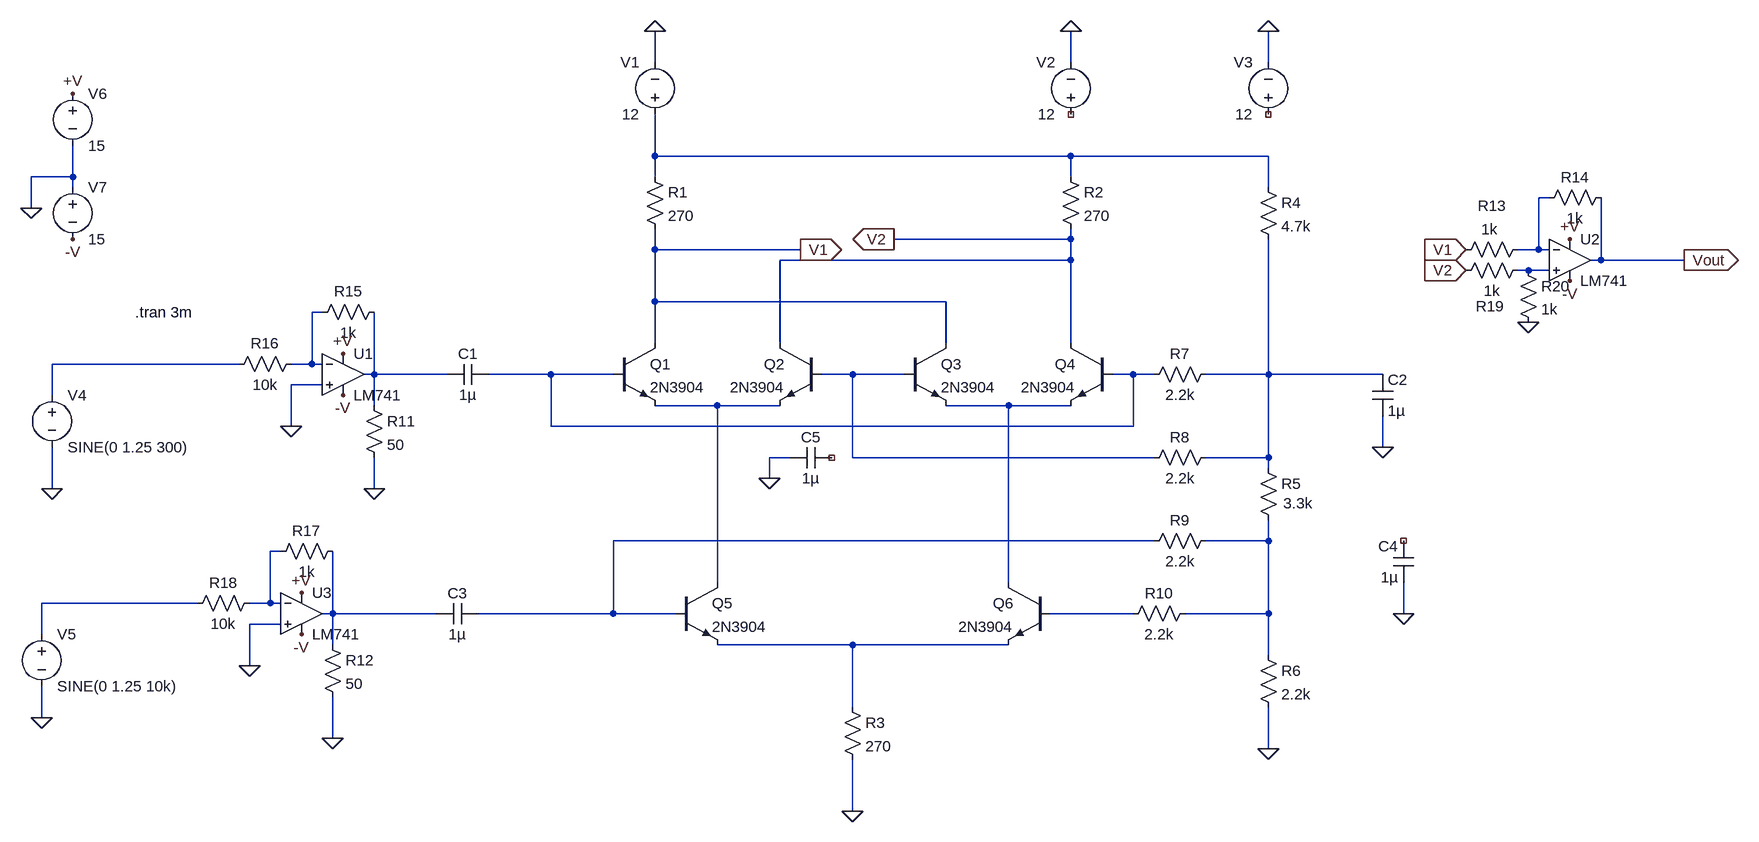
[diagram p0: schematic Multiplier_final.asc]
Multiplier_final.asc, the LTspice schematic file:
Version 4
SHEET 1 1472 1016
WIRE -224 -176 -224 -224
WIRE 416 -176 416 -224
WIRE 720 -176 720 -224
WIRE -224 -32 -224 -96
WIRE 416 -32 -224 -32
WIRE 720 -32 416 -32
WIRE -1120 0 -1120 -48
WIRE -1120 0 -1184 0
WIRE -224 0 -224 -32
WIRE 416 0 416 -32
WIRE -1120 16 -1120 0
WIRE 720 16 720 -32
WIRE 1152 32 1136 32
WIRE -1184 48 -1184 0
WIRE 416 96 416 80
WIRE 416 96 144 96
WIRE -224 112 -224 80
WIRE 0 112 -224 112
WIRE 1136 112 1136 32
WIRE 1136 112 1104 112
WIRE 1152 112 1136 112
WIRE 416 128 416 96
WIRE 416 128 -32 128
WIRE 1232 128 1232 32
WIRE 1232 128 1216 128
WIRE 1360 128 1232 128
WIRE 1120 144 1104 144
WIRE 1152 144 1120 144
WIRE -224 192 -224 112
WIRE 224 192 -224 192
WIRE -736 208 -752 208
WIRE -224 256 -224 192
WIRE -32 256 -32 128
WIRE 224 256 224 192
WIRE 416 256 416 128
WIRE -864 288 -1152 288
WIRE -752 288 -752 208
WIRE -752 288 -784 288
WIRE -736 288 -752 288
WIRE -656 304 -656 208
WIRE -656 304 -672 304
WIRE -544 304 -656 304
WIRE -384 304 -480 304
WIRE -288 304 -384 304
WIRE 80 304 32 304
WIRE 160 304 80 304
WIRE 512 304 480 304
WIRE 544 304 512 304
WIRE 720 304 720 96
WIRE 720 304 624 304
WIRE 896 304 720 304
WIRE -736 320 -784 320
WIRE -1152 336 -1152 288
WIRE -656 352 -656 304
WIRE -128 352 -224 352
WIRE -32 352 -128 352
WIRE 320 352 224 352
WIRE 416 352 320 352
WIRE -784 384 -784 320
WIRE -384 384 -384 304
WIRE 512 384 512 304
WIRE 512 384 -384 384
WIRE 896 416 896 368
WIRE -16 432 -48 432
WIRE 80 432 80 304
WIRE 544 432 80 432
WIRE 720 432 720 304
WIRE 720 432 624 432
WIRE 720 448 720 432
WIRE -48 464 -48 432
WIRE -1152 480 -1152 416
WIRE -656 480 -656 432
WIRE 544 560 -288 560
WIRE 720 560 720 528
WIRE 720 560 624 560
WIRE -800 576 -816 576
WIRE -128 624 -128 352
WIRE 320 624 320 352
WIRE -928 656 -1168 656
WIRE -816 656 -816 576
WIRE -816 656 -848 656
WIRE -800 656 -816 656
WIRE -720 672 -720 576
WIRE -720 672 -736 672
WIRE -560 672 -720 672
WIRE -288 672 -288 560
WIRE -288 672 -496 672
WIRE -192 672 -288 672
WIRE 512 672 384 672
WIRE 720 672 720 560
WIRE 720 672 592 672
WIRE 928 672 928 624
WIRE -800 688 -848 688
WIRE -1168 704 -1168 656
WIRE -720 720 -720 672
WIRE 80 720 -128 720
WIRE 320 720 80 720
WIRE 720 736 720 672
WIRE -848 752 -848 688
WIRE 80 816 80 720
WIRE -1168 832 -1168 784
WIRE -720 864 -720 800
WIRE 720 880 720 816
WIRE 80 976 80 896
FLAG -224 -224 0
FLAG 416 -224 0
FLAG 720 -224 0
FLAG 720 880 0
FLAG 80 976 0
FLAG 896 416 0
FLAG 928 672 0
FLAG -48 464 0
FLAG -1152 480 0
FLAG -1168 832 0
FLAG -656 480 0
FLAG -720 864 0
FLAG -1184 48 0
FLAG -1120 -128 +V
FLAG -1120 96 -V
FLAG -704 272 +V
FLAG -704 336 -V
FLAG -784 384 0
FLAG -768 640 +V
FLAG -768 704 -V
FLAG -848 752 0
FLAG 0 112 V1
IOPIN 0 112 Out
FLAG 144 96 V2
IOPIN 144 96 Out
FLAG 1184 96 +V
FLAG 1184 160 -V
FLAG 1024 112 V1
IOPIN 1024 112 In
FLAG 1024 144 V2
IOPIN 1024 144 In
FLAG 1120 224 0
FLAG 1360 128 Vout
IOPIN 1360 128 Out
SYMBOL res -240 -16 R0
SYMATTR InstName R1
SYMATTR Value 270
SYMBOL res 400 -16 R0
SYMATTR InstName R2
SYMATTR Value 270
SYMBOL res 64 800 R0
SYMATTR InstName R3
SYMATTR Value 270
SYMBOL res 704 0 R0
SYMATTR InstName R4
SYMATTR Value 4.7k
SYMBOL res 704 432 R0
WINDOW 3 39 70 Left 2
SYMATTR Value 3.3k
SYMATTR InstName R5
SYMBOL res 704 720 R0
SYMATTR InstName R6
SYMATTR Value 2.2k
SYMBOL res 640 288 R90
WINDOW 0 0 56 VBottom 2
WINDOW 3 32 56 VTop 2
SYMATTR InstName R7
SYMATTR Value 2.2k
SYMBOL res 640 416 R90
WINDOW 0 0 56 VBottom 2
WINDOW 3 32 56 VTop 2
SYMATTR InstName R8
SYMATTR Value 2.2k
SYMBOL res 640 544 R90
WINDOW 0 0 56 VBottom 2
WINDOW 3 32 56 VTop 2
SYMATTR InstName R9
SYMATTR Value 2.2k
SYMBOL res 608 656 R90
WINDOW 0 0 56 VBottom 2
WINDOW 3 32 56 VTop 2
SYMATTR InstName R10
SYMATTR Value 2.2k
SYMBOL npn -288 256 R0
SYMATTR InstName Q1
SYMATTR Value 2N3904
SYMBOL npn 32 256 M0
SYMATTR InstName Q2
SYMATTR Value 2N3904
SYMBOL npn 160 256 R0
SYMATTR InstName Q3
SYMATTR Value 2N3904
SYMBOL npn 480 256 M0
SYMATTR InstName Q4
SYMATTR Value 2N3904
SYMBOL voltage -224 -80 R180
WINDOW 0 24 96 Left 2
WINDOW 3 24 16 Left 2
WINDOW 123 0 0 Left 0
WINDOW 39 0 0 Left 0
SYMATTR InstName V1
SYMATTR Value 12
SYMBOL voltage 416 -80 R180
WINDOW 0 24 96 Left 2
WINDOW 3 24 16 Left 2
WINDOW 123 0 0 Left 0
WINDOW 39 0 0 Left 0
SYMATTR InstName V2
SYMATTR Value 12
SYMBOL voltage 720 -80 R180
WINDOW 0 24 96 Left 2
WINDOW 3 24 16 Left 2
WINDOW 123 0 0 Left 0
WINDOW 39 0 0 Left 0
SYMATTR InstName V3
SYMATTR Value 12
SYMBOL voltage -1152 320 R0
WINDOW 123 0 0 Left 0
WINDOW 39 0 0 Left 0
SYMATTR InstName V4
SYMATTR Value SINE(0 1.25 300)
SYMBOL voltage -1168 688 R0
WINDOW 123 0 0 Left 0
WINDOW 39 0 0 Left 0
SYMATTR InstName V5
SYMATTR Value SINE(0 1.25 10k)
SYMBOL npn -192 624 R0
SYMATTR InstName Q5
SYMATTR Value 2N3904
SYMBOL npn 384 624 M0
SYMATTR InstName Q6
SYMATTR Value 2N3904
SYMBOL cap -480 288 R90
WINDOW 0 0 32 VBottom 2
WINDOW 3 32 32 VTop 2
SYMATTR InstName C1
SYMATTR Value 1µ
SYMBOL cap 880 304 R0
SYMATTR InstName C2
SYMATTR Value 1µ
SYMBOL cap -496 656 R90
WINDOW 0 0 32 VBottom 2
WINDOW 3 32 32 VTop 2
SYMATTR InstName C3
SYMATTR Value 1µ
SYMBOL cap 944 624 R180
WINDOW 0 24 56 Left 2
WINDOW 3 24 8 Left 2
SYMATTR InstName C4
SYMATTR Value 1µ
SYMBOL cap 48 416 R90
WINDOW 0 0 32 VBottom 2
WINDOW 3 32 32 VTop 2
SYMATTR InstName C5
SYMATTR Value 1µ
SYMBOL res -672 336 R0
SYMATTR InstName R11
SYMATTR Value 50
SYMBOL res -736 704 R0
SYMATTR InstName R12
SYMATTR Value 50
SYMBOL voltage -1120 -144 R0
WINDOW 123 0 0 Left 0
WINDOW 39 0 0 Left 0
SYMATTR InstName V6
SYMATTR Value 15
SYMBOL voltage -1120 0 R0
WINDOW 123 0 0 Left 0
WINDOW 39 0 0 Left 0
SYMATTR InstName V7
SYMATTR Value 15
SYMBOL OpAmps\\LM741 -704 240 R0
SYMATTR InstName U1
SYMBOL res -640 192 R90
WINDOW 0 0 56 VBottom 2
WINDOW 3 32 56 VTop 2
SYMATTR InstName R15
SYMATTR Value 1k
SYMBOL res -768 272 R90
WINDOW 0 0 56 VBottom 2
WINDOW 3 32 56 VTop 2
SYMATTR InstName R16
SYMATTR Value 10k
SYMBOL OpAmps\\LM741 -768 608 R0
SYMATTR InstName U3
SYMBOL res -704 560 R90
WINDOW 0 0 56 VBottom 2
WINDOW 3 32 56 VTop 2
SYMATTR InstName R17
SYMATTR Value 1k
SYMBOL res -832 640 R90
WINDOW 0 0 56 VBottom 2
WINDOW 3 32 56 VTop 2
SYMATTR InstName R18
SYMATTR Value 10k
SYMBOL OpAmps\\LM741 1184 64 R0
SYMATTR InstName U2
SYMBOL res 1248 16 R90
WINDOW 0 0 56 VBottom 2
WINDOW 3 32 56 VTop 2
SYMATTR InstName R14
SYMATTR Value 1k
SYMBOL res 1120 96 R90
WINDOW 0 -36 56 VBottom 2
WINDOW 3 -31 60 VTop 2
SYMATTR InstName R13
SYMATTR Value 1k
SYMBOL res 1120 128 R90
WINDOW 0 87 59 VBottom 2
WINDOW 3 32 56 VTop 2
SYMATTR InstName R19
SYMATTR Value 1k
SYMBOL res 1104 128 R0
SYMATTR InstName R20
SYMATTR Value 1k
TEXT -1024 208 Left 2 !.tran 3m

The netlist it stands for:
* Multiplier_final.asc
R1 N001 V1 270
R2 N001 V2 270
R3 N018 0 270
R4 N001 N009 4.7k
R5 N009 N013 3.3k
R6 N013 0 2.2k
R7 N009 N007 2.2k
R8 N009 N008 2.2k
R9 N013 N012 2.2k
R10 N013 N017 2.2k
Q1 V1 N007 N010 0 2N3904
Q2 V2 N008 N010 0 2N3904
Q3 V1 N008 N011 0 2N3904
Q4 V2 N007 N011 0 2N3904
V1 N001 0 12
V2 NC_01 0 12
V3 NC_02 0 12
V4 N005 0 SINE(0 1.25 300)
V5 N015 0 SINE(0 1.25 10k)
Q5 N010 N012 N018 0 2N3904
Q6 N011 N017 N018 0 2N3904
C1 N007 N006 1µ
C2 N009 0 1µ
C3 N012 N016 1µ
C4 0 NC_03 1µ
C5 NC_04 0 1µ
R11 N006 0 50
R12 N016 0 50
V6 +V 0 15
V7 0 -V 15
XU1 0 N004 +V -V N006 LM741  ; pins In+ In- V+ V- OUT
R15 N006 N004 1k
R16 N004 N005 10k
XU3 0 N014 +V -V N016 LM741  ; pins In+ In- V+ V- OUT
R17 N016 N014 1k
R18 N014 N015 10k
XU2 N003 N002 +V -V Vout LM741  ; pins In+ In- V+ V- OUT
R14 Vout N002 1k
R13 N002 V1 1k
R19 N003 V2 1k
R20 N003 0 1k
.model NPN NPN
.model PNP PNP
.lib standard.bjt
.tran 3m
.lib LM741.lib
.backanno
.end